# Altium schematic sheet FMC_Delay_1ns_4Cha.SchDoc: FMC Delay Top
size 420 x 297 mm; CheckedBy: -; CompanyName: CERN; DrawnBy: GK; Organization: CERN; Address1: European Organization for Nuclear Research; Address2: CH-1211 Geneve 23 - Switzerland; Revision: -; SheetNumber: 1; SheetTotal: 9; EDA_Number: EDA-XXXXX-VX-X; Projet: FMC Delay 1ns 4cha; ModifiedBy: -; CheckedDate: -; DivGrp: BE-CO; Designer: GK; ModifiedDate: -; ProjectName: FMC Delay 1ns 4cha
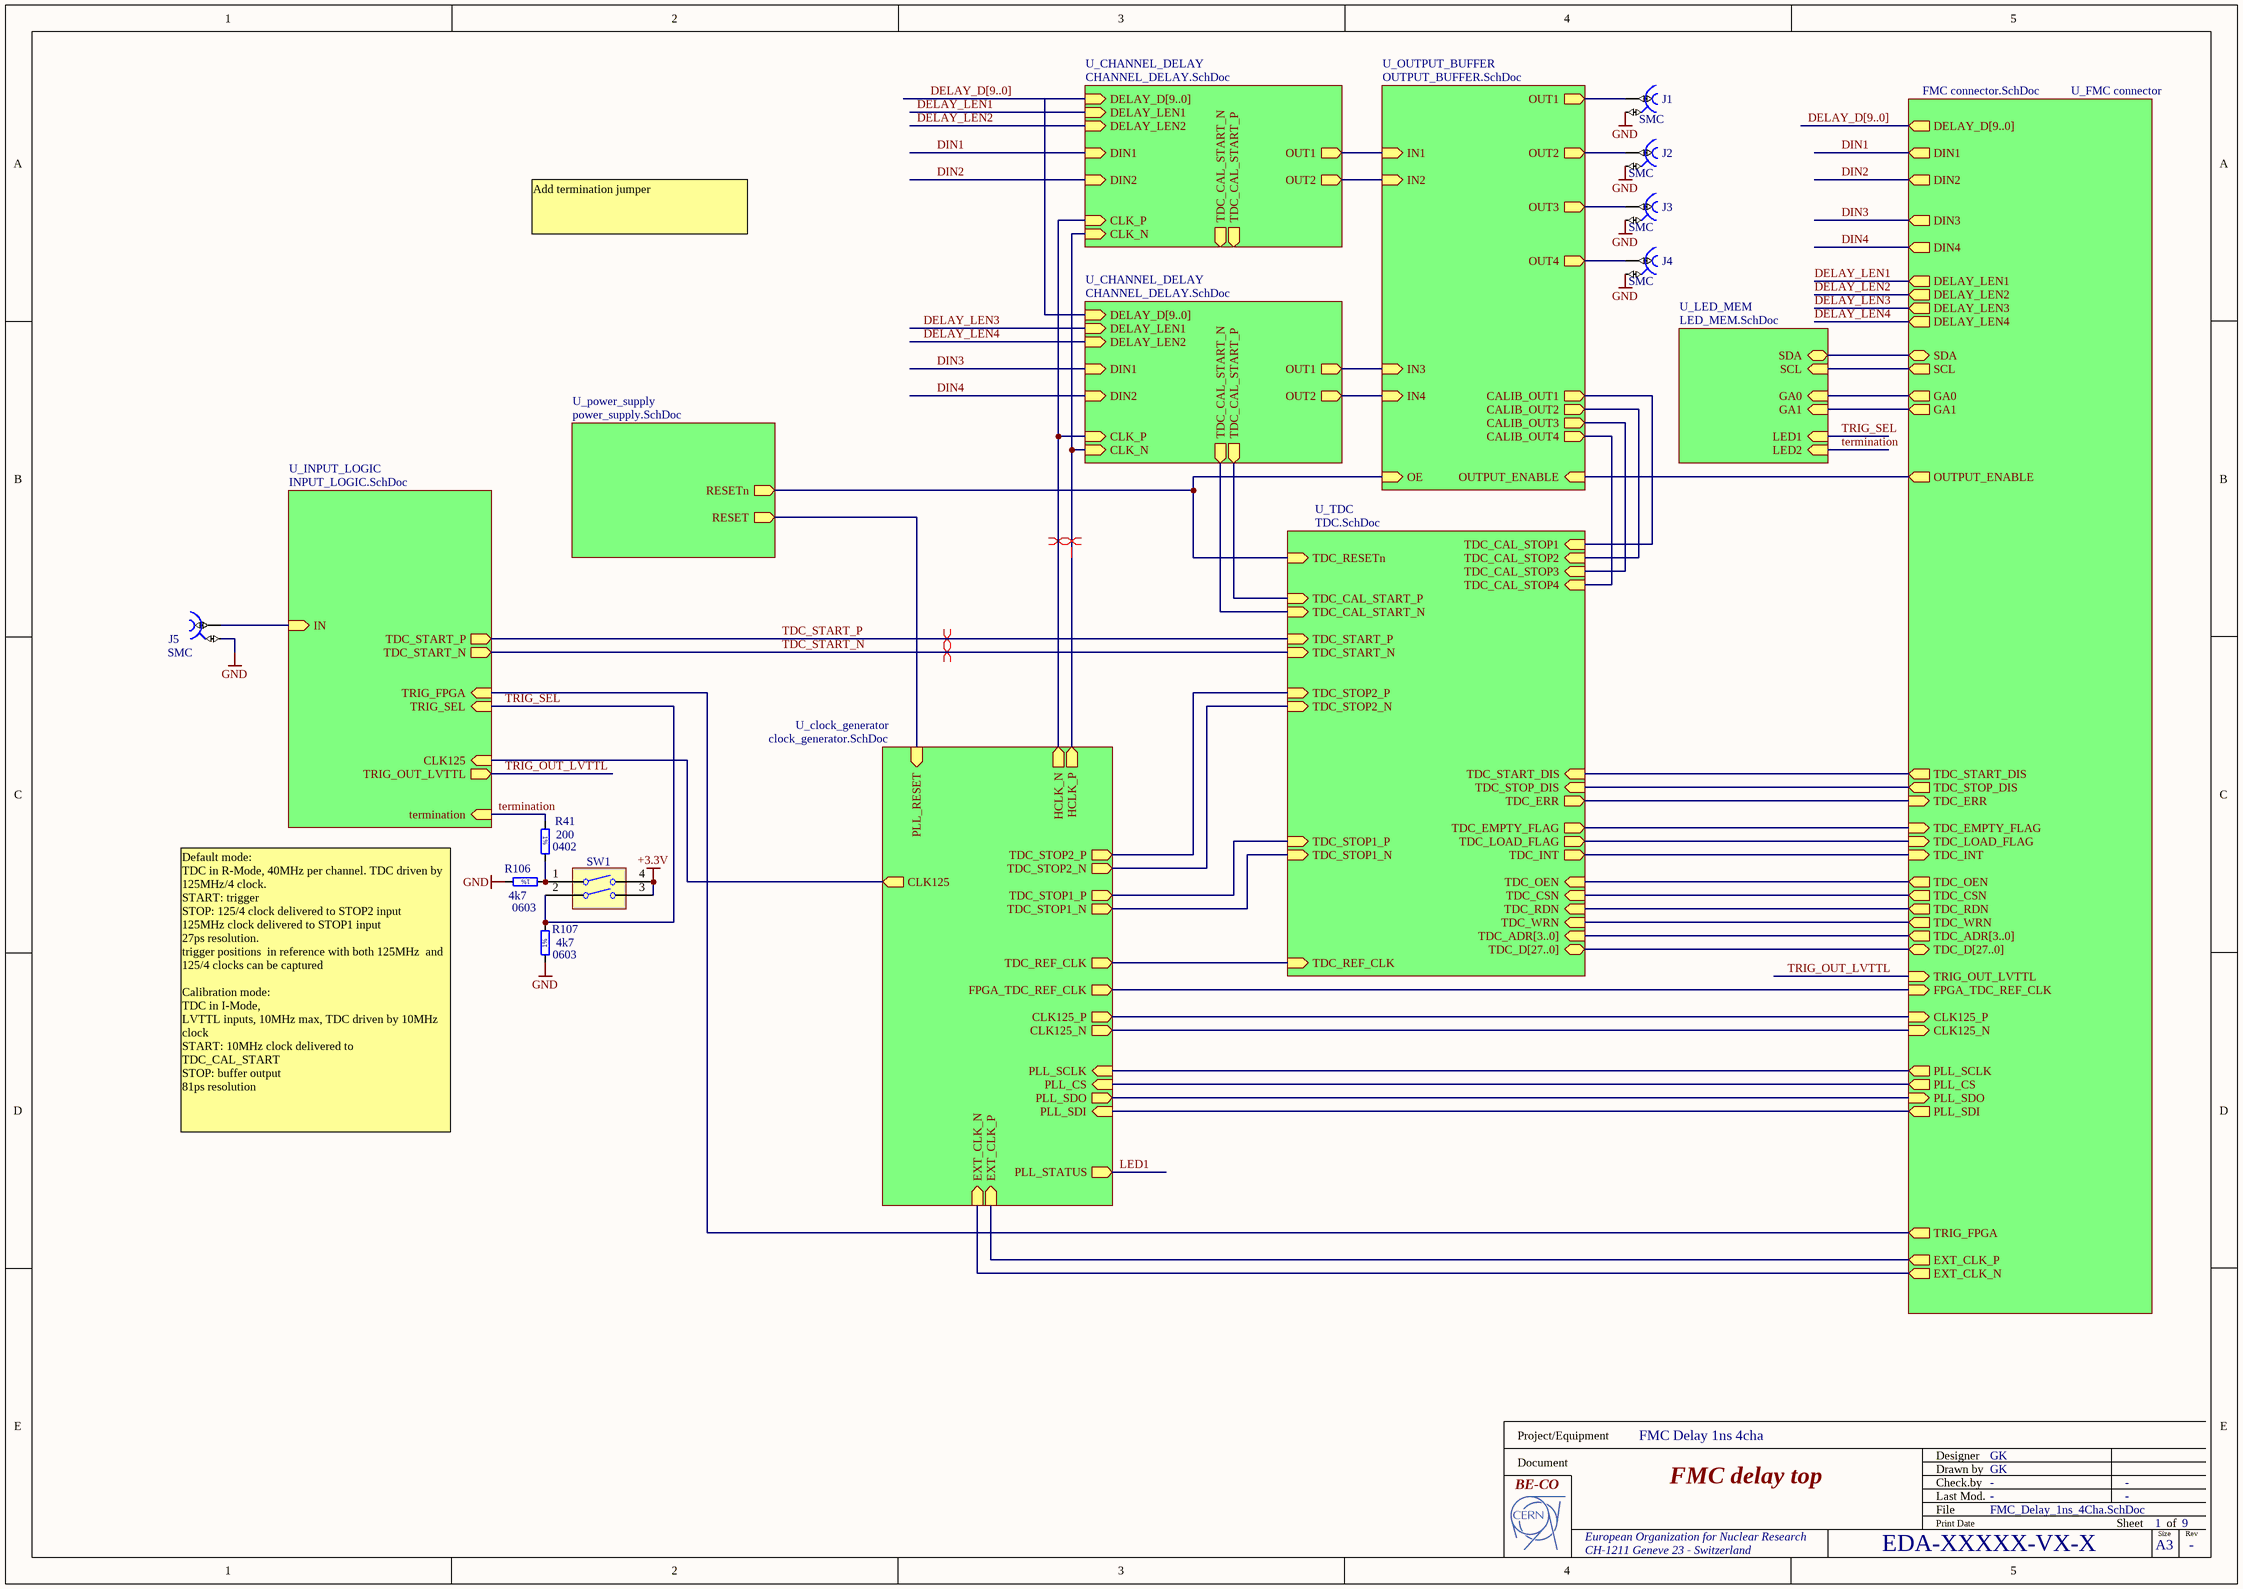
[diagram p0: FMC_Delay_1ns_4Cha.SchDoc]

## Parts
J1  SMC  [JOHNSON_131-6701-341]
J2  SMC  [JOHNSON_131-6701-341]
J3  SMC  [JOHNSON_131-6701-341]
J4  SMC  [JOHNSON_131-6701-341]
J5  SMC  [JOHNSON_131-6701-341]
R41  200  Case: 0402  [RESC1005X40N]
R106  4k7  Case: 0603  [RESC1608X55N]
R107  4k7  Case: 0603  [RESC1608X55N]
SW1  Switch  [SW_TYCO_1571983-1]  (value not drawn)

## Sub-sheets
U_CHANNEL_DELAY = CHANNEL_DELAY.SchDoc: DELAY_D[9..0] (in), DELAY_LEN1 (in), DELAY_LEN2 (in), DIN1 (in), DIN2 (in), CLK_N (in), CLK_P (in), OUT1 (out), OUT2 (out), TDC_CAL_START_P (out), TDC_CAL_START_N (out)
U_CHANNEL_DELAY = CHANNEL_DELAY.SchDoc: DELAY_D[9..0] (in), DELAY_LEN1 (in), DELAY_LEN2 (in), DIN1 (in), DIN2 (in), CLK_N (in), CLK_P (in), OUT1 (out), OUT2 (out), TDC_CAL_START_P (out), TDC_CAL_START_N (out)
U_clock_generator = clock_generator.SchDoc: EXT_CLK_N (in), EXT_CLK_P (in), HCLK_P (out), HCLK_N (out), PLL_CS (in), PLL_SCLK (in), PLL_SDO (out), PLL_RESET (in), PLL_SDI (in), TDC_REF_CLK (out), TDC_STOP2_P (out), TDC_STOP2_N (out), TDC_STOP1_P (out), TDC_STOP1_N (out), CLK125_N (out), CLK125_P (out), CLK125 (out), FPGA_TDC_REF_CLK (out), PLL_STATUS (out)
U_FMC connector = FMC connector.SchDoc: DIN1 (out), DIN2 (out), DIN3 (out), DIN4 (out), EXT_CLK_P (out), EXT_CLK_N (out), SDA (bidir), SCL (out), GA0 (out), GA1 (out), TDC_START_DIS (out), TDC_STOP_DIS (out), TDC_EMPTY_FLAG (in), TDC_LOAD_FLAG (in), TDC_INT (in), TDC_OEN (out), TDC_CSN (out), TDC_RDN (out), TDC_WRN (out), TDC_ADR[3..0] (out), TDC_D[27..0] (bidir), DELAY_LEN1 (out), DELAY_LEN2 (out), DELAY_LEN3 (out), DELAY_LEN4 (out), PLL_SCLK (out), PLL_CS (out), PLL_SDO (in), PLL_SDI (out), CLK125_P (in), CLK125_N (in), FPGA_TDC_REF_CLK (in), TRIG_OUT_LVTTL (in), DELAY_D[9..0] (out), TDC_ERR (in), OUTPUT_ENABLE (out), TRIG_FPGA (out)
U_INPUT_LOGIC = INPUT_LOGIC.SchDoc: TDC_START_N (out), TDC_START_P (out), IN (in), termination (in), CLK125 (in), TRIG_OUT_LVTTL (out), TRIG_FPGA (in), TRIG_SEL (in)
U_LED_MEM = LED_MEM.SchDoc: SDA (bidir), SCL (in), GA0 (in), GA1 (in), LED1 (in), LED2 (in)
U_OUTPUT_BUFFER = OUTPUT_BUFFER.SchDoc: IN1 (in), IN2 (in), IN3 (in), IN4 (in), OUT1 (out), OUT2 (out), OUT3 (out), OUT4 (out), OE (in), CALIB_OUT1 (out), CALIB_OUT2 (out), CALIB_OUT3 (out), CALIB_OUT4 (out), OUTPUT_ENABLE (in)
U_power_supply = power_supply.SchDoc: RESET (out), RESETn (out)
U_TDC = TDC.SchDoc: TDC_ADR[3..0] (in), TDC_START_P (in), TDC_START_N (in), TDC_STOP1_P (in), TDC_STOP1_N (in), TDC_STOP2_P (in), TDC_STOP2_N (in), TDC_CAL_STOP1 (in), TDC_CAL_STOP2 (in), TDC_CAL_STOP3 (in), TDC_CAL_STOP4 (in), TDC_START_DIS (in), TDC_STOP_DIS (in), TDC_EMPTY_FLAG (out), TDC_LOAD_FLAG (out), TDC_INT (out), TDC_REF_CLK (in), TDC_RESETn (in), TDC_D[27..0] (bidir), TDC_OEN (in), TDC_CSN (in), TDC_RDN (in), TDC_WRN (in), TDC_CAL_START_N (in), TDC_CAL_START_P (in), TDC_ERR (out)

## Nets
+3.3V: SW1.3 SW1.4
GND: J1.2 J2.2 J3.2 J4.2 J5.2 R106.2 R107.1
DELAY_LEN1: sheet U_FMC connector/DELAY_LEN1, sheet U_CHANNEL_DELAY/DELAY_LEN1
DELAY_LEN2: sheet U_FMC connector/DELAY_LEN2, sheet U_CHANNEL_DELAY/DELAY_LEN2
DELAY_LEN3: sheet U_FMC connector/DELAY_LEN3, sheet U_CHANNEL_DELAY/DELAY_LEN1
DELAY_LEN4: sheet U_FMC connector/DELAY_LEN4, sheet U_CHANNEL_DELAY/DELAY_LEN2
DIN1: sheet U_FMC connector/DIN1, sheet U_CHANNEL_DELAY/DIN1
DIN2: sheet U_FMC connector/DIN2, sheet U_CHANNEL_DELAY/DIN2
DIN3: sheet U_FMC connector/DIN3, sheet U_CHANNEL_DELAY/DIN1
DIN4: sheet U_FMC connector/DIN4, sheet U_CHANNEL_DELAY/DIN2
LED1: sheet U_clock_generator/PLL_STATUS
TDC_START_N: sheet U_TDC/TDC_START_N, sheet U_INPUT_LOGIC/TDC_START_N
TDC_START_P: sheet U_TDC/TDC_START_P, sheet U_INPUT_LOGIC/TDC_START_P
termination: R41.1 ; sheet U_LED_MEM/LED2, sheet U_INPUT_LOGIC/termination
TRIG_OUT_LVTTL: sheet U_FMC connector/TRIG_OUT_LVTTL, sheet U_INPUT_LOGIC/TRIG_OUT_LVTTL
TRIG_SEL: R107.2 SW1.2 ; sheet U_LED_MEM/LED1, sheet U_INPUT_LOGIC/TRIG_SEL
NetJ1_1: J1.1 ; sheet U_OUTPUT_BUFFER/OUT1
NetJ2_1: J2.1 ; sheet U_OUTPUT_BUFFER/OUT2
NetJ3_1: J3.1 ; sheet U_OUTPUT_BUFFER/OUT3
NetJ4_1: J4.1 ; sheet U_OUTPUT_BUFFER/OUT4
NetJ5_1: J5.1 ; sheet U_INPUT_LOGIC/IN
NetR41_2: R41.2 R106.1 SW1.1
(unnamed): sheet U_clock_generator/EXT_CLK_N, sheet U_FMC connector/EXT_CLK_N
(unnamed): sheet U_clock_generator/EXT_CLK_P, sheet U_FMC connector/EXT_CLK_P
(unnamed): sheet U_clock_generator/HCLK_P, sheet U_CHANNEL_DELAY/CLK_N, sheet U_CHANNEL_DELAY/CLK_N
(unnamed): sheet U_clock_generator/HCLK_N, sheet U_CHANNEL_DELAY/CLK_P, sheet U_CHANNEL_DELAY/CLK_P
(unnamed): sheet U_clock_generator/PLL_CS, sheet U_FMC connector/PLL_CS
(unnamed): sheet U_clock_generator/PLL_SCLK, sheet U_FMC connector/PLL_SCLK
(unnamed): sheet U_clock_generator/PLL_SDO, sheet U_FMC connector/PLL_SDO
(unnamed): sheet U_clock_generator/PLL_RESET, sheet U_power_supply/RESET
(unnamed): sheet U_clock_generator/PLL_SDI, sheet U_FMC connector/PLL_SDI
(unnamed): sheet U_clock_generator/TDC_REF_CLK, sheet U_TDC/TDC_REF_CLK
(unnamed): sheet U_clock_generator/TDC_STOP2_P, sheet U_TDC/TDC_STOP2_P
(unnamed): sheet U_clock_generator/TDC_STOP2_N, sheet U_TDC/TDC_STOP2_N
(unnamed): sheet U_clock_generator/TDC_STOP1_P, sheet U_TDC/TDC_STOP1_P
(unnamed): sheet U_clock_generator/TDC_STOP1_N, sheet U_TDC/TDC_STOP1_N
(unnamed): sheet U_clock_generator/CLK125_N, sheet U_FMC connector/CLK125_N
(unnamed): sheet U_clock_generator/CLK125_P, sheet U_FMC connector/CLK125_P
(unnamed): sheet U_clock_generator/CLK125, sheet U_INPUT_LOGIC/CLK125
(unnamed): sheet U_clock_generator/FPGA_TDC_REF_CLK, sheet U_FMC connector/FPGA_TDC_REF_CLK
(unnamed): sheet U_FMC connector/SDA, sheet U_LED_MEM/SDA
(unnamed): sheet U_FMC connector/SCL, sheet U_LED_MEM/SCL
(unnamed): sheet U_FMC connector/GA0, sheet U_LED_MEM/GA0
(unnamed): sheet U_FMC connector/GA1, sheet U_LED_MEM/GA1
(unnamed): sheet U_FMC connector/TDC_START_DIS, sheet U_TDC/TDC_START_DIS
(unnamed): sheet U_FMC connector/TDC_STOP_DIS, sheet U_TDC/TDC_STOP_DIS
(unnamed): sheet U_FMC connector/TDC_EMPTY_FLAG, sheet U_TDC/TDC_EMPTY_FLAG
(unnamed): sheet U_FMC connector/TDC_LOAD_FLAG, sheet U_TDC/TDC_LOAD_FLAG
(unnamed): sheet U_FMC connector/TDC_INT, sheet U_TDC/TDC_INT
(unnamed): sheet U_FMC connector/TDC_OEN, sheet U_TDC/TDC_OEN
(unnamed): sheet U_FMC connector/TDC_CSN, sheet U_TDC/TDC_CSN
(unnamed): sheet U_FMC connector/TDC_RDN, sheet U_TDC/TDC_RDN
(unnamed): sheet U_FMC connector/TDC_WRN, sheet U_TDC/TDC_WRN
(unnamed): sheet U_FMC connector/TDC_ERR, sheet U_TDC/TDC_ERR
(unnamed): sheet U_FMC connector/OUTPUT_ENABLE, sheet U_OUTPUT_BUFFER/OUTPUT_ENABLE
(unnamed): sheet U_FMC connector/TRIG_FPGA, sheet U_INPUT_LOGIC/TRIG_FPGA
(unnamed): sheet U_power_supply/RESETn, sheet U_TDC/TDC_RESETn, sheet U_OUTPUT_BUFFER/OE
(unnamed): sheet U_TDC/TDC_CAL_STOP1, sheet U_OUTPUT_BUFFER/CALIB_OUT1
(unnamed): sheet U_TDC/TDC_CAL_STOP2, sheet U_OUTPUT_BUFFER/CALIB_OUT2
(unnamed): sheet U_TDC/TDC_CAL_STOP3, sheet U_OUTPUT_BUFFER/CALIB_OUT3
(unnamed): sheet U_TDC/TDC_CAL_STOP4, sheet U_OUTPUT_BUFFER/CALIB_OUT4
(unnamed): sheet U_TDC/TDC_CAL_START_N, sheet U_CHANNEL_DELAY/TDC_CAL_START_N
(unnamed): sheet U_TDC/TDC_CAL_START_P, sheet U_CHANNEL_DELAY/TDC_CAL_START_P
(unnamed): sheet U_CHANNEL_DELAY/OUT1, sheet U_OUTPUT_BUFFER/IN1
(unnamed): sheet U_CHANNEL_DELAY/OUT2, sheet U_OUTPUT_BUFFER/IN2
(unnamed): sheet U_CHANNEL_DELAY/OUT1, sheet U_OUTPUT_BUFFER/IN3
(unnamed): sheet U_CHANNEL_DELAY/OUT2, sheet U_OUTPUT_BUFFER/IN4

## Buses and harness runs
bus DELAY_D[9..0] = sheet U_CHANNEL_DELAY/DELAY_D[9..0]
bus DELAY_D[9..0] = sheet U_FMC connector/DELAY_D[9..0]
bus sheet U_FMC connector/TDC_ADR[3..0] = sheet U_TDC/TDC_ADR[3..0]
bus sheet U_FMC connector/TDC_D[27..0] = sheet U_TDC/TDC_D[27..0]

## Layout directives
differential pair: (no net found under the mark), TDC_START_N, TDC_START_P

## Notes on the sheet
- Add termination jumper
- Default mode:
  TDC in R-Mode, 40MHz per channel. TDC driven by 125MHz/4 clock.
  START: trigger
  STOP: 125/4 clock delivered to STOP2 input
  125MHz clock delivered to STOP1 input
  27ps resolution.
  trigger positions  in reference with both 125MHz  and 125/4 clocks can be captured
  Calibration mode:
  TDC in I-Mode,
  LVTTL inputs, 10MHz max, TDC driven by 10MHz clock
  START: 10MHz clock delivered to TDC_CAL_START
  STOP: buffer output
  81ps resolution
- Project/Equipment
- Document
- FMC delay top
- Designer
- Drawn by
- Check.by
- File
- Last Mod.
- Print Date
- Sheet
- Size
- A3
- of
- Rev
- (in symbol R0402_200R_1%_0.0625W_100PPM) 1%
- (in symbol R0603_4K7_1%_0.1W_100PPM) 1%

## Library data of the parts
J1-J5 = JOHNSON_131-6701-341: Part Description: SMC 50 Ohm Right Angle Bulkhead Jack Receptacle; Manufacturer Part Number: 142-0701-873; Table: Miscellaneous; Part Number: JOHNSON_131-6701-341; Component Kind: Standard; Component Type: Standard; Pin Count: 2; Family: SMC; Mounted: Yes; Socket: No; SMD: No; Status: None; Manufacturer: JOHNSON; ComponentHeight: 7.67mm; HelpURL: \\cern.ch\dfs\Applications\Altium\Datasheets\JOHNSON_131-6701-341.pdf; Author: CERN DEM JLC; CreateDate: 16.02.2010; LatestRevisionDate: 16.02.2010
R41 = R0402_200R_1%_0.0625W_100PPM: Resistor - 1%; Part Description: General Purpose Thick Film Chip Resistor; Manufacturer: GENERIC; Manufacturer1 Part Number: 232270672001; TC: ±100ppm/°C; Table: Resistors SMD; Part Number: R0402_200R_1%_0.0625W_100PPM; Component Kind: Standard; Component Type: Standard; Pin Count: 2; Value: 200; Status: Not recommended; Power: 0.0625W; Tolerance: ±1%; Manufacturer Part Number: R0402_200R_1%_0.0625W_100PPM; Mounted: Yes; Socket: No; SMD: Yes; Manufacturer1 Example: PHYCOMP; Manufacturer1 ComponentHeight: 0.4mm; HelpURL: \\cern.ch\dfs\Applications\Altium\Datasheets\R0402_Phycomp_RC0402.pdf; Author: CERN DEM JLC; CreateDate: 12/3/2007; LatestRevisionDate: 3/13/2008
R106 R107 = R0603_4K7_1%_0.1W_100PPM: Resistor - 1%; Part Description: General Purpose Thick Film Chip Resistor; Manufacturer: GENERIC; Manufacturer1 Part Number: NRC06F4701TRF; Power: 0.1W; TC: ±100ppm/°C; Table: Resistors SMD; Part Number: R0603_4K7_1%_0.1W_100PPM; Component Kind: Standard; Component Type: Standard; Pin Count: 2; Value: 4k7; Status: Preferred; Tolerance: ±1%; Manufacturer Part Number: R0603_4K7_1%_0.1W_100PPM; Mounted: Yes; Socket: No; SMD: Yes; Manufacturer1 Example: NIC COMPONENT; Manufacturer1 ComponentHeight: 0.55mm; HelpURL: \\cern.ch\dfs\Applications\Altium\Datasheets\R0603_NIC_NRC.pdf; Author: CERN DEM JLC; CreateDate: 2007-12-03; LatestRevisionDate: 2008-03-13
SW1 = SW_TYCO_1571983-1: 2 Ways SPST DIP Switch; Part Description: 2 Way SPST SMD DIP Switch, Latched, Contact Rating 0.025A 24VDC; Manufacturer: TYCO; Manufacturer Part Number: 1571983-1 or GDH02S04; Table: Switches; Part Number: SW_TYCO_1571983-1; Component Kind: Standard; Component Type: Standard; Pin Count: 4; PackageDescription: Pitch 1.27mm,  Body3.66x6.2mm, 2 Ways SPST Surface-Mount DIP Switch, TYCO GDH Serie; Family: Switch; Mounted: Yes; Socket: No; SMD: Yes; Status: None; ComponentHeight: 2.31mm; HelpURL: \\cern.ch\dfs\Applications\Altium\Datasheets\SW_TYCO_1571983-1.pdf; Author: CERN DEM JLC; CreateDate: 2009-01-08; LatestRevisionDate: 2009-01-08